# Altium schematic sheet SinCos_Conditioning.SchDoc: Sin and Cos signals conditioning
size A3; Organization: ORGANIZATION; Address1: ADDRESS 1; Address2: ADDRESS 2; Address3: ADDRESS 3; Address4: ADDRESS 4; Revision: 0.0; SheetNumber: 7; SheetTotal: 19; ENG_APP_DATE: --/--/--; DSN_APP_DATE: --/--/--; CHK_APP_DATE: --/--/--
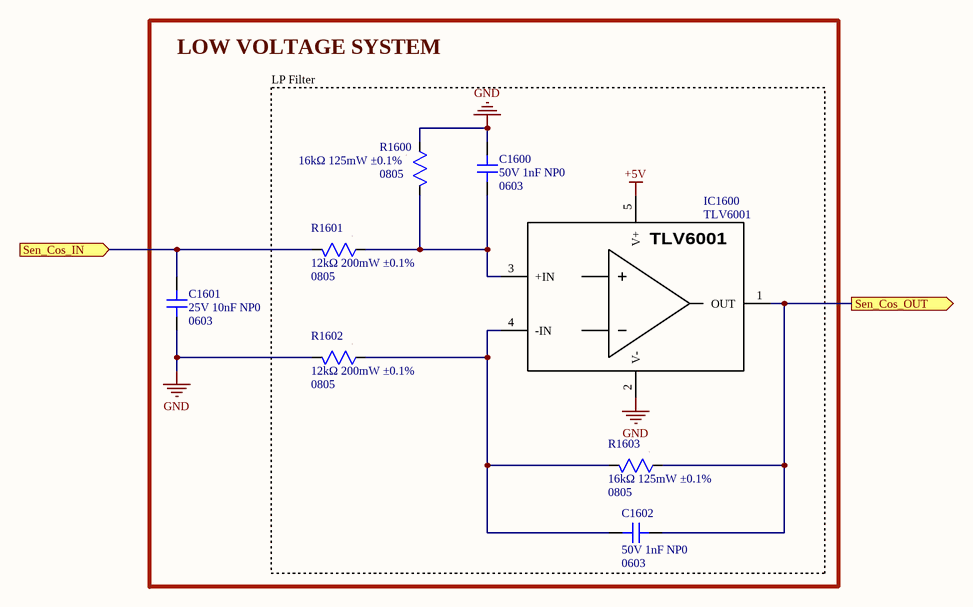
[diagram p0: SinCos_Conditioning.SchDoc]

## Parts
C1600  value 50V 1nF NP0  Package: 0603  [CAP SMD 0603]  (hidden comment: CAP non polarized)
C1601  value 25V 10nF NP0  Package: 0603  [CAP SMD 0603]  (hidden comment: CAP non polarized)
C1602  value 50V 1nF NP0  Package: 0603  [CAP SMD 0603]  (hidden comment: CAP non polarized)
IC1600  TLV6001  [SOT-23-5]
R1600  value 16kΩ 125mW ±0.1%  Package: 0805  [RES SMD 0805]  (hidden comment: RES)
R1601  value 12kΩ 200mW ±0.1%  Package: 0805  [RES SMD 0805]  (hidden comment: RES)
R1602  value 12kΩ 200mW ±0.1%  Package: 0805  [RES SMD 0805]  (hidden comment: RES)
R1603  value 16kΩ 125mW ±0.1%  Package: 0805  [RES SMD 0805]  (hidden comment: RES)

## Blocks framed on the sheet
LOW VOLTAGE SYSTEM: C1601
LP Filter: C1600 C1602 IC1600 R1600-R1603

## Ports
Sen_Cos_IN (in), Sen_Cos_OUT (out)

## Nets
+5V: IC1600.5(V+)
GND: C1600.2 C1601.2 IC1600.2(V-) R1600.1 R1602.2
Sen_Cos_IN: C1601.1 R1601.2 ; port Sen_Cos_IN
Sen_Cos_OUT: C1602.2 IC1600.1(OUT) R1603.1 ; port Sen_Cos_OUT
NetC1600_1: C1600.1 IC1600.3(+IN) R1600.2 R1601.1
NetC1602_1: C1602.1 IC1600.4(-IN) R1602.1 R1603.2

## Notes on the sheet
- Project:
- Subsystem:
- Company:
- Document:
- Author:
- Revision:
- Date:
- Sheet:
- /

## Library data of the parts
C1600 C1602 = 001-0127: Condensadores de cerámica multicapa (MLCC- SMD/SMT) WCAP-CSGP 1000pF 0603 5% 50V MLCC; MPN: 885012006063; Manufacturer: Wurth Elektronik; ComponentLink1Description: Datasheet; ComponentLink1URL: https://www.we-online.com/components/products/datasheet/885012006063.pdf; ComponentLink2Description: Distributor Link; ComponentLink2URL: https://www.mouser.es/ProductDetail/Wurth-Elektronik/885012006063?qs=0KOYDY2FL29yUmMQmcJrdA%3D%3D; ID: 001-0127; Distributor PN: 710-885012006063; Distributor: Mouser
C1601 = 001-0109: Condensadores de cerámica multicapa (MLCC- SMD/SMT) 50V 5100pF 0603 C0G 1%; MPN: C0603C512F5GACTU; Manufacturer: KEMET; ComponentLink1Description: Datasheet; ComponentLink1URL: https://www.mouser.es/datasheet/3/72/1/C0603C512F5GACTU.pdf; ComponentLink2Description: Distributor Link; ComponentLink2URL: https://www.mouser.es/ProductDetail/KEMET/C0603C512F5GACTU?qs=Fn3VdHBzkcmgqbeAGPfrXg%3D%3D; ID: 001-0109; Distributor PN: 80-C0603C512F5G; Distributor: Mouser
IC1600 = 062-0002: Amplificadores operacionales - Op Amps Single 5.5-V 1-MHz R RIO operational a A A 595-TLV6001UIDBVT; MPN: TLV6001UIDBVR; Manufacturer: Texas Instruments; ID: 062-0002; ComponentLink1URL: https://www.ti.com/lit/ds/symlink/tlv6001.pdf?ts=1781607824916&ref_url=https%253A%252F%252Fcz.mouser.com%252F; ComponentLink2URL: https://www.mouser.es/ProductDetail/Texas-Instruments/TLV6001UIDBVR?qs=8N88piwwHEgntIgM8jjJ5Q%3D%3D; Value: -; Package: SOT-23-5; Distributor PN: 595-TLV6001UIDBVR; Distributor: Mouser
R1600 R1603 = 010-0184: Resistores de película fina - SMD 0805 16Kohm 0.1% 10ppm AEC-Q200; MPN: ERA-6ARB163V; Manufacturer: Panasonic; ComponentLink1Description: Datasheet; ComponentLink1URL: https://industrial.panasonic.com/cdbs/www-data/pdf/RDM0000/AOA0000C307.pdf; ComponentLink2Description: Distributor Link; ComponentLink2URL: https://www.mouser.es/ProductDetail/Panasonic/ERA-6ARB163V?qs=sGAEpiMZZMtlubZbdhIBIJiMSTY83nT4nukUMCYb38k%3D; ID: 010-0184; Distributor PN: 667-ERA-6ARB163V; Distributor: Mouser
R1601 R1602 = 010-0186: Resistores de película fina - SMD RQ 0805 12K1 0.1% 10PPM 5K RL; MPN: RQ73C2A12K1BTD; Manufacturer: TE Connectivity / Holsworthy; ComponentLink1Description: Datasheet; ComponentLink1URL: https://www.te.com/en/product-9-2176380-9.html; ComponentLink2Description: Distributor Link; ComponentLink2URL: https://www.mouser.es/ProductDetail/TE-Connectivity-Holsworthy/RQ73C2A12K1BTD?qs=gZXFycFWdAO8owZcKCpcmw%3D%3D; ID: 010-0186; Distributor PN: 279-RQ73C2A12K1BTD; Distributor: Mouser